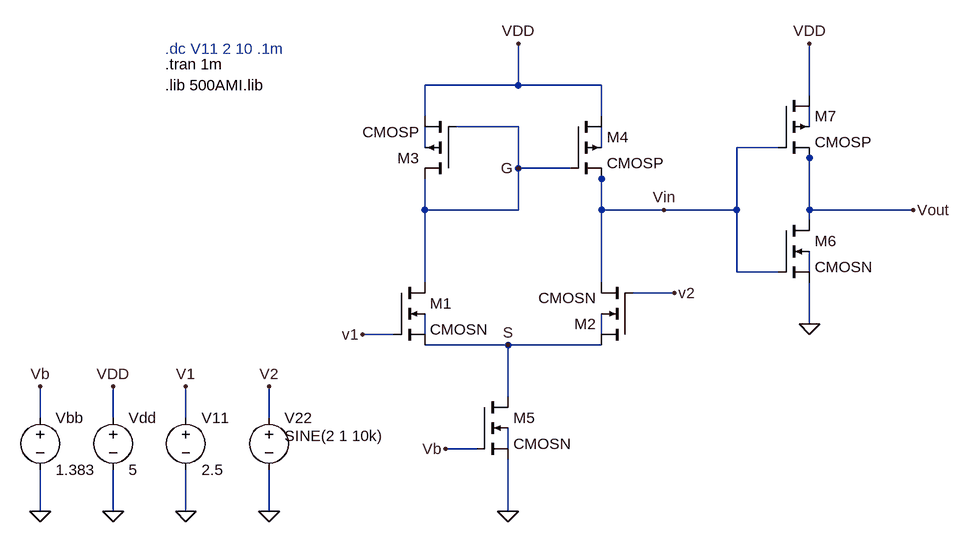
[diagram p0: schematic conversor v1.0.asc]
conversor v1.0.asc, the LTspice schematic file:
Version 4
SHEET 1 2980 680
WIRE 144 -416 144 -480
WIRE 144 -416 0 -416
WIRE 272 -416 144 -416
WIRE 592 -400 592 -480
WIRE 0 -368 0 -416
WIRE 272 -368 272 -416
WIRE 144 -352 48 -352
WIRE 592 -352 592 -384
WIRE 0 -320 0 -352
WIRE 272 -320 272 -352
WIRE 544 -320 480 -320
WIRE 592 -304 592 -320
WIRE 144 -288 144 -352
WIRE 224 -288 144 -288
WIRE 272 -272 272 -288
WIRE 0 -224 0 -272
WIRE 144 -224 144 -288
WIRE 144 -224 0 -224
WIRE 272 -224 272 -272
WIRE 368 -224 272 -224
WIRE 480 -224 480 -320
WIRE 480 -224 368 -224
WIRE 592 -224 592 -304
WIRE 752 -224 592 -224
WIRE 592 -208 592 -224
WIRE 480 -128 480 -224
WIRE 544 -128 480 -128
WIRE 592 -128 592 -160
WIRE 0 -112 0 -224
WIRE 272 -112 272 -224
WIRE 384 -96 320 -96
WIRE 592 -48 592 -112
WIRE -48 -32 -96 -32
WIRE 0 -32 0 -64
WIRE 272 -32 272 -64
WIRE 128 -16 0 -16
WIRE 272 -16 128 -16
WIRE 128 64 128 -16
WIRE -592 96 -592 48
WIRE -480 96 -480 48
WIRE -368 96 -368 48
WIRE -240 96 -240 48
WIRE 80 144 32 144
WIRE 128 144 128 112
WIRE -592 240 -592 176
WIRE -480 240 -480 176
WIRE -368 240 -368 176
WIRE -240 240 -240 176
WIRE 128 240 128 160
FLAG -480 240 0
FLAG 128 240 0
FLAG 32 144 Vb
FLAG 144 -480 VDD
FLAG -480 48 VDD
FLAG -368 240 0
FLAG -368 48 V1
FLAG -240 240 0
FLAG -240 48 V2
FLAG -592 240 0
FLAG -592 48 Vb
FLAG 592 -48 0
FLAG 592 -480 VDD
FLAG 368 -224 Vin
FLAG -96 -32 v1
FLAG 384 -96 v2
FLAG 128 -16 S
FLAG 144 -288 G
FLAG 752 -224 Vout
SYMBOL pmos4 224 -368 R0
SYMATTR InstName M4
SYMATTR Value CMOSP
SYMATTR Value2 l=10u w=10u
SYMBOL nmos4 80 64 R0
SYMATTR InstName M5
SYMATTR Value CMOSN
SYMATTR Value2 l=10u w=10u
SYMBOL voltage -480 80 R0
WINDOW 123 0 0 Left 0
WINDOW 39 0 0 Left 0
SYMATTR InstName Vdd
SYMATTR Value 5
SYMBOL nmos4 320 -16 R180
SYMATTR InstName M2
SYMATTR Value CMOSN
SYMATTR Value2 l=10u w=10u
SYMBOL pmos4 48 -272 R180
SYMATTR InstName M3
SYMATTR Value CMOSP
SYMATTR Value2 l=10u w=10u
SYMBOL voltage -368 80 R0
WINDOW 123 0 0 Left 0
WINDOW 39 0 0 Left 0
SYMATTR InstName V11
SYMATTR Value 2.5
SYMBOL voltage -240 80 R0
WINDOW 3 24 44 Left 2
WINDOW 123 0 0 Left 0
WINDOW 39 0 0 Left 0
SYMATTR InstName V22
SYMATTR Value SINE(2 1 10k)
SYMBOL voltage -592 80 R0
WINDOW 123 0 0 Left 0
WINDOW 39 0 0 Left 0
SYMATTR InstName Vbb
SYMATTR Value 1.383
SYMBOL nmos4 -48 -112 R0
SYMATTR InstName M1
SYMATTR Value CMOSN
SYMATTR Value2 l=10u w=10u
SYMBOL nmos4 544 -208 R0
SYMATTR InstName M6
SYMATTR Value CMOSN
SYMATTR Value2 l=10u w=10u
SYMBOL pmos4 544 -400 R0
SYMATTR InstName M7
SYMATTR Value CMOSP
SYMATTR Value2 l=10u w=10u
TEXT -400 -448 Left 2 !.tran 1m
TEXT -400 -472 Left 2 ;.dc V11 2 10 .1m
TEXT -400 -416 Left 2 !.lib 500AMI.lib

The netlist it stands for:
* conversor v1.0.asc
M4 VDD G Vin N003 CMOSP l=10u w=10u
M5 S Vb 0 N007 CMOSN l=10u w=10u
Vdd VDD 0 5
M2 S V2 Vin N006 CMOSN l=10u w=10u
M3 G G VDD N002 CMOSP l=10u w=10u
V11 V1 0 2.5
V22 V2 0 SINE(2 1 10k)
Vbb Vb 0 1.383
M1 G V1 S N005 CMOSN l=10u w=10u
M6 Vout Vin 0 N004 CMOSN l=10u w=10u
M7 VDD Vin Vout N001 CMOSP l=10u w=10u
.model NMOS NMOS
.model PMOS PMOS
.lib standard.mos
.tran 1m
* .dc V11 2 10 .1m
.lib 500AMI.lib
.backanno
.end